# EAGLE design devBoard (EAGLE 9.5.2)
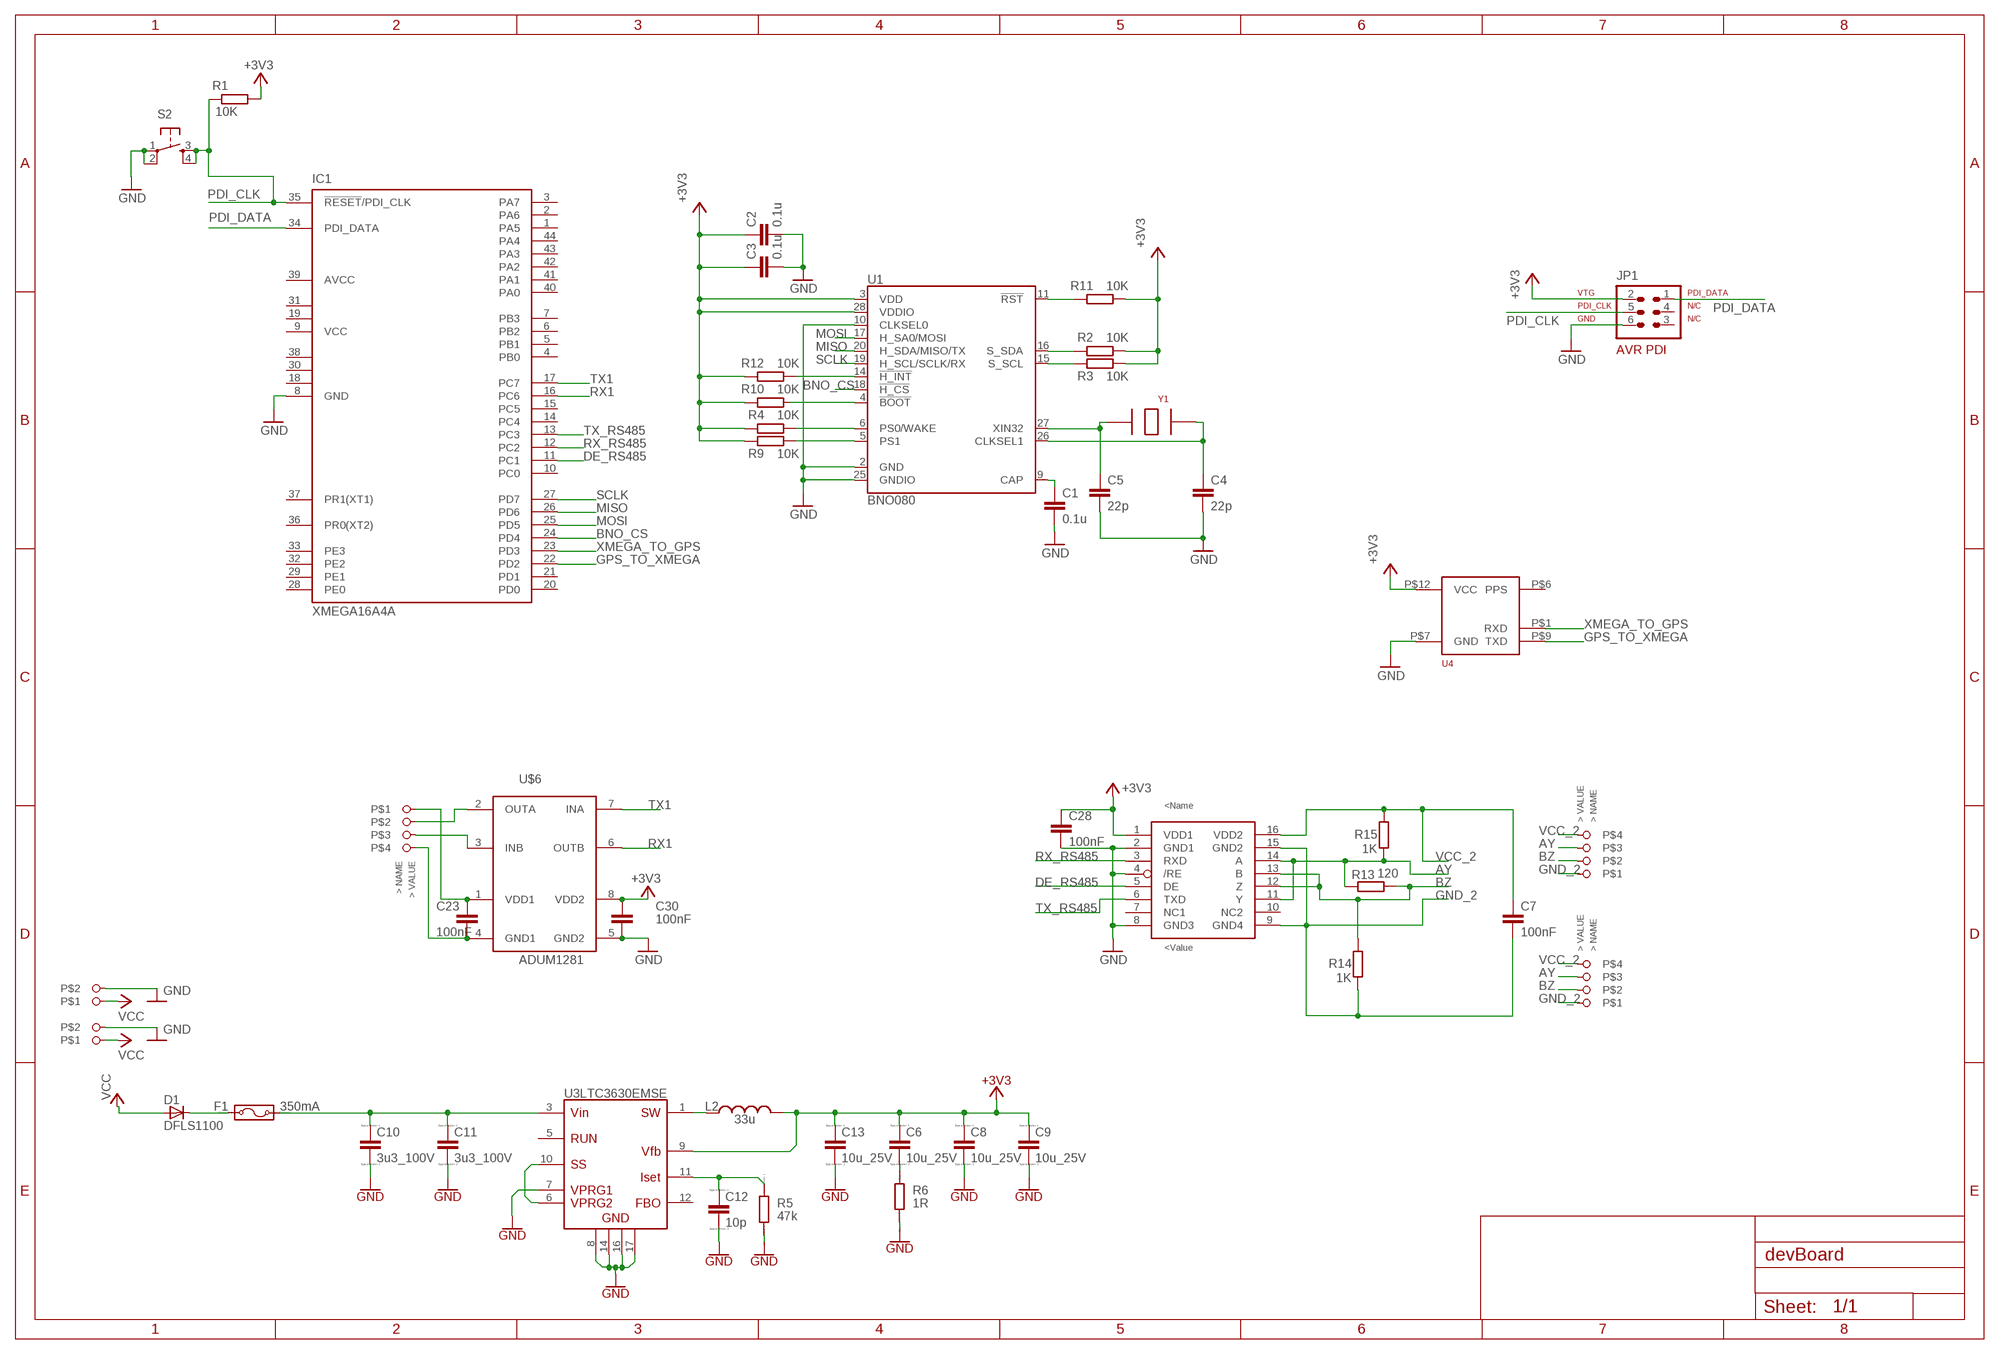
[diagram p0: schematic, sheet 1]

## Parts
ADM1  ADM2484E  [ADM2487]
C1  0.1u  C-EUC0805  [C0805]
C2  0.1u  C-EUC0805  [C0805]
C3  0.1u  C-EUC0805  [C0805]
C4  22p  C-EUC0805  [C0805]
C5  22p  C-EUC0805  [C0805]
C6  10u_25V  CAP1206  [1206]
C7  100nF  C-EUC0805  [C0805]
C8  10u_25V  CAP1206  [1206]
C9  10u_25V  CAP1206  [1206]
C10  3u3_100V  CAP1206  [1206]
C11  3u3_100V  CAP1206  [1206]
C12  10p  CAP0805  [0805]
C13  10u_25V  CAP1206  [1206]
C23  100nF  C-EUC0805  [C0805]
C28  100nF  C-EUC0805  [C0805]
C30  100nF  C-EUC0805  [C0805]
D1  DFLS1100  [POWERDI_123]
F1  350mA  RESETTABLE_FUSE1812  [1812L]
IC1  XMEGA16A4A  [TQFP44]
JP1  AVR-ISP-6ML  [ML6]
L2  33u  DR74  [DR73/74]
POWER1  CON_3.81MM2_SIDE  [CON_3.81MM2_SIDE]
POWER2  CON_3.81MM2_SIDE  [CON_3.81MM2_SIDE]
R1  10K  R-EU_R0805  [R0805]
R2  10K  R-EU_R0805  [R0805]
R3  10K  R-EU_R0805  [R0805]
R4  10K  R-EU_R0805  [R0805]
R5  47k  RES0805  [0805]
R6  1R  RES0805  [0805]
R9  10K  R-EU_R0805  [R0805]
R10  10K  R-EU_R0805  [R0805]
R11  10K  R-EU_R0805  [R0805]
R12  10K  R-EU_R0805  [R0805]
R13  120  R-EU_R0805  [R0805]
R14  1K  R-EU_R0805  [R0805]
R15  1K  R-EU_R0805  [R0805]
S2  TAC_SWITCHPTH  [TACTILE-PTH]
SERIEEL  CON_3,5MM4_SIDE  [CON_3,5MM4_SIDE]
SERIEEL1  CON_3,5MM4_SIDE  [CON_3,5MM4_SIDE]
SERIEEL2  CON_3,5MM4_SIDE  [CON_3,5MM4_SIDE]
U1  BNO080  [LGA-28]
U3  LTC3630EMSE  [MSE16(12)]
U4  NAVSPARK_MININAVSPARK_MINI  [NAVSPARK_MINI]
U$6  ADUM1281  [SOIC8]
Y1  ABS07  [ABS07]

## Nets
+3V3: ADM1.1(VDD1) C2.1 C3.1 C6.1 C8.1 C9.1 C13.1 C28.1 C30.2 JP1.2 L2.2 R1.1 R2.1 R3.1 R4.2 R9.2 R10.2 R11.1 R12.2 U1.3(VDD) U1.28(VDDIO) U3.9(VFB) U4.P$12(VCC) U$6.8(VDD2)
AY: ADM1.11(Y) ADM1.14(A) R13.2 R15.1 SERIEEL1.P3 SERIEEL2.P3
BNO080_BOOT: R10.1 U1.4(!BOOT)
BNO_CS: IC1.24(PD4) U1.18(!H_CS)
BZ: ADM1.12(Z) ADM1.13(B) R13.1 R14.2 SERIEEL1.P2 SERIEEL2.P2
DE_RS485: ADM1.5(DE) IC1.11(PC1)
GND: ADM1.2(GND1) ADM1.4(/RE) ADM1.8(GND3) C1.2 C2.2 C3.2 C4.2 C5.2 C8.2 C9.2 C10.2 C11.2 C12.2 C13.2 C28.2 C30.1 IC1.8(GND) JP1.6 POWER1.P$2 POWER2.P$2 R5.2 R6.2 S2.1 S2.2 U1.2(GND) U1.10(CLKSEL0) U1.25(GNDIO) U3.7(VPRG1) U3.8(GND1) U3.14(GND2) U3.16(GND3) U3.17(GND4) U4.P$7(GND) U$6.5(GND2)
GND4: C23.1 SERIEEL.P4 U$6.4(GND1)
GND_2: ADM1.9(GND4) ADM1.15(GND2) C7.2 R14.1 SERIEEL1.P1 SERIEEL2.P1
GPS_TO_XMEGA: IC1.22(PD2) U4.P$9(TXD)
INB: SERIEEL.P3 U$6.3(INB)
MISO: IC1.26(PD6) U1.20(H_SDA/MISO/TX)
MOSI: IC1.25(PD5) U1.17(H_SA0/MOSI)
N$1: C1.1 U1.9(CAP)
N$2: C10.1 C11.1 F1.2 U3.3(VIN)
N$3: D1.C F1.1
N$4: C5.1 U1.27(XIN32) Y1.P$2
N$5: C4.1 U1.26(CLKSEL1) Y1.P$1
N$6: R2.2 U1.16(S_SDA)
N$7: R3.2 U1.15(S_SCL)
N$8: R4.1 U1.6(PS0/WAKE)
N$9: R9.1 U1.5(PS1)
N$10: R11.2 U1.11(!RST)
N$11: U3.6(VPRG2) U3.10(SS)
N$12: R12.1 U1.14(!H_INT)
N$13: C12.1 R5.1 U3.11(ISET)
N$15: L2.1 U3.1(SW)
N$16: C6.2 R6.1
OUTA: SERIEEL.P2 U$6.2(OUTA)
PDI_CLK: IC1.35(!RESET!/PDI_CLK) JP1.5 R1.2 S2.3 S2.4
PDI_DATA: IC1.34(PDI_DATA) JP1.1
RX1: IC1.16(PC6) U$6.6(OUTB)
RX_RS485: ADM1.3(RXD) IC1.12(PC2)
SCLK: IC1.27(PD7) U1.19(H_SCL/SCLK/RX)
TX1: IC1.17(PC7) U$6.7(INA)
TX_RS485: ADM1.6(TXD) IC1.13(PC3)
VCC [VCC]: D1.A POWER1.P$1 POWER2.P$1
VCC_2: ADM1.16(VDD2) C7.1 R15.2 SERIEEL1.P4 SERIEEL2.P4
VDD_1: C23.2 SERIEEL.P1 U$6.1(VDD1)
XMEGA_TO_GPS: IC1.23(PD3) U4.P$1(RXD)
Unconnected: ADM1.7(NC1) ADM1.10(NC2) IC1.1(PA5) IC1.2(PA6) IC1.3(PA7) IC1.4(PB0) IC1.5(PB1) IC1.6(PB2) IC1.7(PB3) IC1.10(PC0) IC1.14(PC4) IC1.15(PC5) IC1.20(PD0) IC1.21(PD1) IC1.28(PE0) IC1.29(PE1) IC1.32(PE2) IC1.33(PE3) IC1.36(PR0(XT2)) IC1.37(PR1(XT1)) IC1.40(PA0) IC1.41(PA1) IC1.42(PA2) IC1.43(PA3) IC1.44(PA4) JP1.3 JP1.4 U3.5(RUN) U3.12(FBO) U4.P$6(PPS)

## Power pins joined to a net without a drawn wire
AVCC: IC1.39(AVCC)
GND1: IC1.18(GND1)
GND2: IC1.30(GND2)
GND3: IC1.38(GND3)
VCC1: IC1.19(VCC1)
VCC2: IC1.31(VCC2)
VCC_2: IC1.9(VCC)

## Library data of the parts
ADM1 = ADM:ADM2484E
C1-C5 = rcl:C-EU: CAPACITOR, European symbol; SPICEPREFIX: C
C6 C8-C13 = Capacitor:CAP
C7 C23 C28 C30 = rcl:C-EU: CAPACITOR, European symbol
D1 = Diode:DFLS1100
F1 = Fuse:RESETTABLE_FUSE
IC1 = atmel:XMEGA16A4: MICROCONTROLLER Features High-performance, Low-power 8/16-bit AVR XMEGA Microcontroller Non-Volatile Program and Data Memories - 16 KB - 128 KB of In-System Self-Programmable Flash - 4 KB - 8 KB Boot Code Section with Independent Lock Bits - 1 KB - 2 KB EEPROM - 2 KB - 8 KB Internal SRAM Peripheral Features - Four-channel DMA Controller with support for external requests - Eight-channel Event System - Five 16-bit Timer/Counters Three Timer/Counters with 4 Output Compare or Input Capture channels Two Timer/Counters with 2 Output Compare or Input Capture channels High-Resolution Extensions on all Timer/Counters Advanced Waveform Extension on one Timer/Counter - Five USARTs IrDA Extension on one USART - Two Two-Wire Interfaces with dual address match (I2C and SMBus compatible) - Two SPIs (Serial Peripheral Interfaces) peripherals - AES and DES Crypto Engine - 16-bit Real Time Counter with Separate Oscillator - One Twelve-channel, 12-bit, 2 Msps Analog to Digital Converter - One Two-channel, 12-bit, 1 Msps Digital to Analog Converter - Two Analog Comparators with Window compare function - External Interrupts on all General Purpose I/O pins - Programmable Watchdog Timer with Separate On-chip Ultra Low Power Oscillator Special Microcontroller Features - Power-on Reset and Programmable Brown-out Detection - Internal and External Clock Options with PLL - Programmable Multi-level Interrupt Controller - Sleep Modes: Idle, Power-down, Standby, Power-save, Extended Standby - Advanced Programming, Test and Debugging Interfaces PDI (Program and Debug Interface) for programming, test and debugging I/O and Packages - 34 Programmable I/O Lines - 44 - lead TQFP - 44 - pad VQFN/QFN - 49 - ball VFBGA Operating Voltage - 1.6 - 3.6V Speed performance - 0 - 12 MHz @ 1.6 - 3.6V - 0 - 32 MHz @ 2.7 - 3.6V Drawn by Dipl.-Ing. (FH) Robert Siegler Created: 27.05.09; OC_FARNELL: unknown; OC_NEWARK: unknown
JP1 = avr-pdi:AVR-ISP-6: AVR ISP-6 Serial Programming Header
L2 = Inductor:DR74
POWER1 POWER2 = Phoenix-con:CON_3.81MM2_SIDE
R1-R4 R9-R15 = rcl:R-EU_: RESISTOR, European symbol
R5 R6 = Resistor:RES
S2 = SparkFun-Electromechanical:TAC_SWITCH: Momentary Switch Button commonly used for reset or general input. Spark Fun Electronics SKU : COM-00097 SMT- SWCH-08247
SERIEEL SERIEEL1 SERIEEL2 = Phoenix-con:CON_3,5MM4_SIDE
U1 = BNO080:BNO080
U3 = Step_Down_Converter:LTC3630EMSE
U4 = NAVSPARK_MINI:NAVSPARK_MINI
U$6 = ref-packages-v3:ADUM1281
Y1 = ABS07:ABS07

## Net classes
0 default: width 0.2 mm, drill 0.3 mm, clearance 0.2 mm
1 3V3: width 0.5 mm, drill 0.3 mm, clearance 0.2 mm to class 0
4 VCC: width 1 mm, clearance 0.2 mm to class 0

## Board
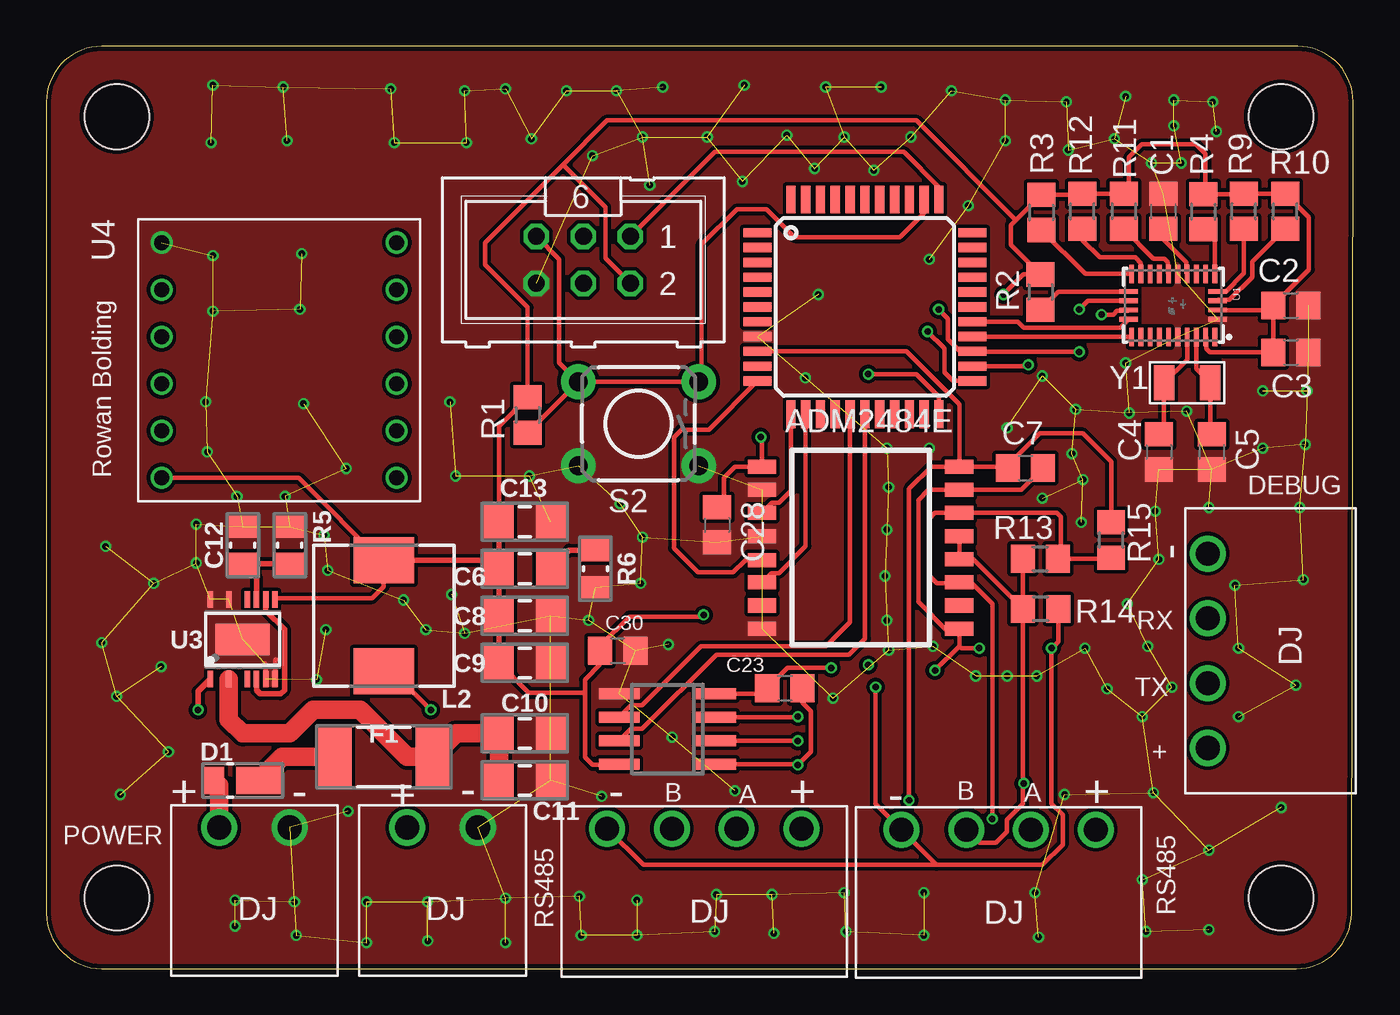
[diagram p1: board, top side]
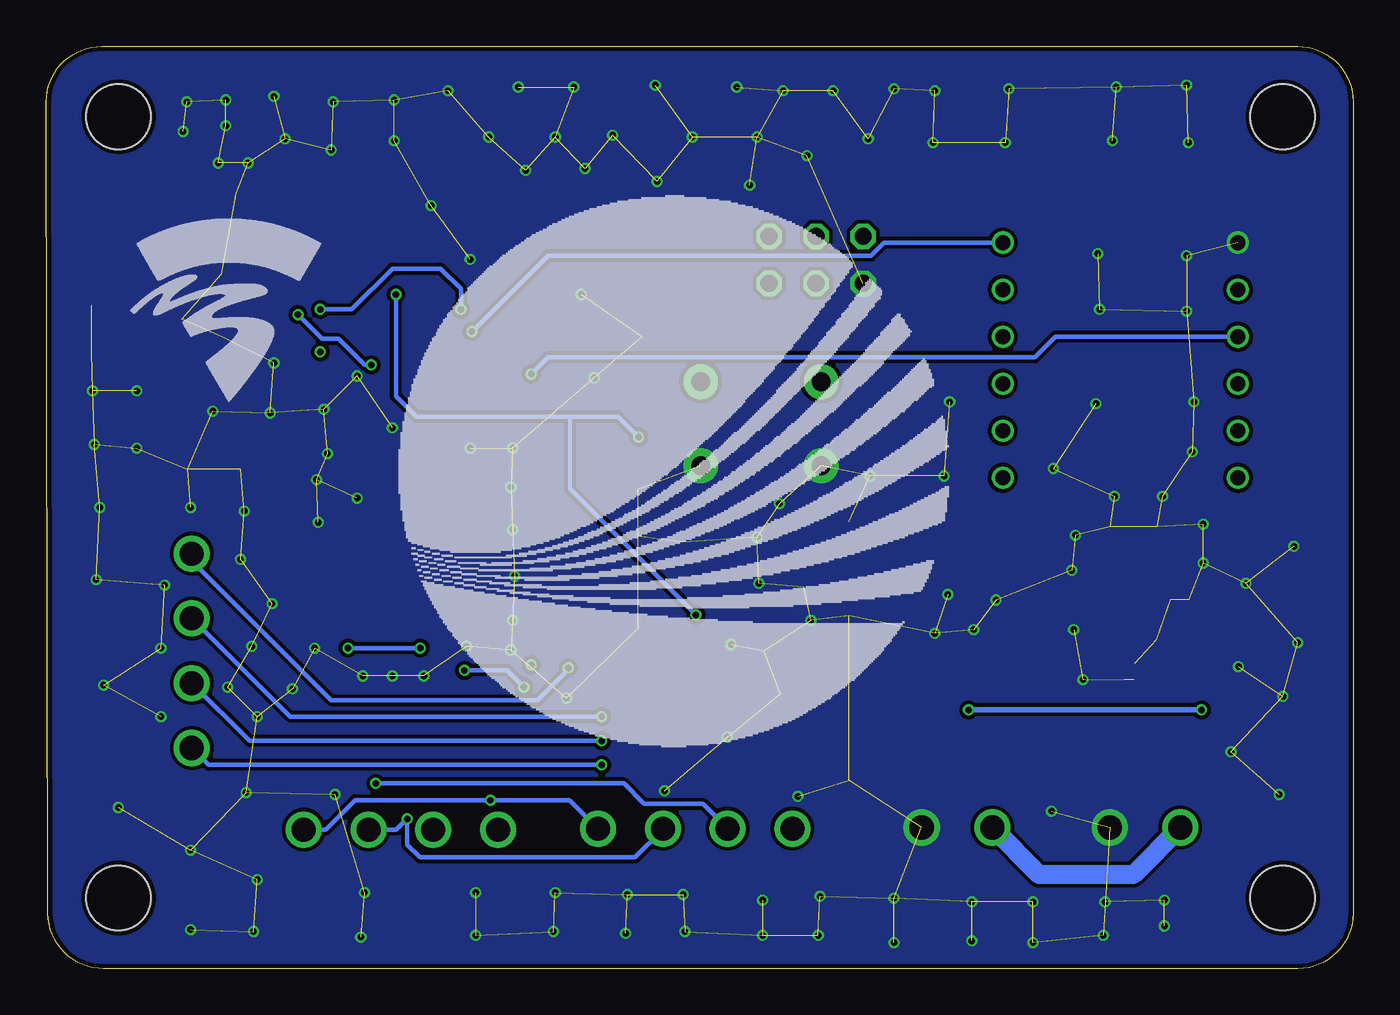
[diagram p2: board, bottom side, seen from below]

Size 70.59 x 49.8 mm. Coordinates in mm from the lower left corner, seen from the top.
Outline: 70.51,2.99 70.59,46.79 arc90 67.59,49.8 3,49.8 arc90 0,46.8 0,2.99 arc90 2.99,0 67.51,0 arc90 70.51,2.99
Copper layers (1*16): Top 0.018mm / dielectric 1.55mm / Bottom 0.018mm
Design rules "eC_2Layer_PClass6_BaseCopperO18_eCDefault": minimum track width 0.15mm, minimum drill 0.35mm, track to track 0.15mm, track to pad 0.15mm, pad to pad 0.15mm, via to via 0.15mm, smd to smd 0mil, copper to edge 0.25mm, drill to drill 0.35mm, minimum pad ring 0.175mm, minimum via ring 0.125mm, stop-mask expansion 0mil, vias tented up to drill 0.45mm, thermal gap 0.2mm
Holes 3.5 mm at 3.81,3.81 3.81,46 66.69,46 66.69,3.81

### Footprints (pad centres in the part's own frame; a part is rotated, then mirrored left to right if it is on the bottom)
ADM2487 = smd 0.76 x 1.525: 1 -4.375,-5.325; 2 -3.125,-5.325; 3 -1.875,-5.325; 4 -0.625,-5.325; 5 0.675,-5.325; 6 1.875,-5.325; 7 3.125,-5.325; 8 4.375,-5.325; 9 4.375,5.325; 10 3.125,5.325; 11 1.875,5.325; 12 0.625,5.325; 13 -0.625,5.325; 14 -1.875,5.325; 15 -3.125,5.325; 16 -4.375,5.325
C0805 = smd 1.3 x 1.5: 1 -0.95,0; 2 0.95,0
1206 = smd 1.6 x 1.8: 1 -1.4,0; 2 1.4,0
0805 = smd 1.2 x 1.5: 1 -1,0; 2 1,0
POWERDI_123 = smd 1.05 x 1.5: A -1.525,0 | smd 2.4 x 1.5: C 0.85,0
1812L = smd 1.8 x 3.15: 1 -2.625,0; 2 2.625,0
TQFP44 = smd 1.5 x 0.5: 1 -5.8,4; 2 -5.8,3.2; 3 -5.8,2.4; 4 -5.8,1.6; 5 -5.8,0.8; 6 -5.8,0; 7 -5.8,-0.8; 8 -5.8,-1.6; 9 -5.8,-2.4; 10 -5.8,-3.2; 11 -5.8,-4; 23 5.8,-4; 24 5.8,-3.2; 25 5.8,-2.4; 26 5.8,-1.6; 27 5.8,-0.8; 28 5.8,0; 29 5.8,0.8; 30 5.8,1.6; 31 5.8,2.4; 32 5.8,3.2; 33 5.8,4 | smd 0.5 x 1.5: 12 -4,-5.8; 13 -3.2,-5.8; 14 -2.4,-5.8; 15 -1.6,-5.8; 16 -0.8,-5.8; 17 0,-5.8; 18 0.8,-5.8; 19 1.6,-5.8; 20 2.4,-5.8; 21 3.2,-5.8; 22 4,-5.8; 34 4,5.8; 35 3.2,5.8; 36 2.4,5.8; 37 1.6,5.8; 38 0.8,5.8; 39 0,5.8; 40 -0.8,5.8; 41 -1.6,5.8; 42 -2.4,5.8; 43 -3.2,5.8; 44 -4,5.8
ML6 = drill 0.914 octagon: 1 -2.54,-1.27; 2 -2.54,1.27; 3 0,-1.27; 4 0,1.27; 5 2.54,-1.27; 6 2.54,1.27
DR73/74 = smd 2.5 x 3.25: 1 -3,0; 2 3,0
CON_3.81MM2_SIDE = drill 1.3: P$1 0,0; P$2 3.81,0
R0805 = smd 1.3 x 1.5: 1 -0.95,0; 2 0.95,0
TACTILE-PTH = drill 1.016 pad 1.88: 1 -3.251,2.261; 2 3.251,2.261; 3 -3.251,-2.261; 4 3.251,-2.261
CON_3,5MM4_SIDE = drill 1.3: P1 -7,0; P2 -3.5,0; P3 0,0; P4 3.5,0
LGA-28 = smd 1 x 0.25: 1 1.7,2.25; 6 -1.7,2.25; 7 -1.7,1.75; 8 -1.7,1.25; 9 -1.7,0.75; 10 -1.7,0.25; 11 -1.7,-0.25; 12 -1.7,-0.75; 13 -1.7,-1.25; 14 -1.7,-1.75; 15 -1.7,-2.25; 20 1.7,-2.25; 21 1.7,-1.75; 22 1.7,-1.25; 23 1.7,-0.75; 24 1.7,-0.25; 25 1.7,0.25; 26 1.7,0.75; 27 1.7,1.25; 28 1.7,1.75 | smd 0.25 x 1: 2 0.75,2.4; 3 0.25,2.4; 4 -0.25,2.4; 5 -0.75,2.4; 16 -0.75,-2.4; 17 -0.25,-2.4; 18 0.25,-2.4; 19 0.75,-2.4
MSE16(12) = smd 0.3 x 0.9: 1 -1.75,-2.15; 3 -0.75,-2.15; 5 0.25,-2.15; 6 0.75,-2.15; 7 1.25,-2.15; 8 1.75,-2.15; 9 1.75,2.15; 10 1.25,2.15; 11 0.75,2.15; 12 0.25,2.15; 14 -0.75,2.15; 16 -1.75,2.15 | smd 2.9 x 1.7: 17 0,0
NAVSPARK_MINI = drill 0.8: P$1 -6.35,6.35; P$2 -3.81,6.35; P$3 -1.27,6.35; P$4 1.27,6.35; P$5 3.81,6.35; P$6 6.35,6.35; P$7 -6.35,-6.35; P$8 -3.81,-6.35; P$9 -1.27,-6.35; P$10 1.27,-6.35; P$11 3.81,-6.35; P$12 6.35,-6.35
SOIC8 = smd 0.6 x 2.2: 1 -1.905,-2.6; 2 -0.635,-2.6; 3 0.635,-2.6; 4 1.905,-2.6; 5 1.905,2.6; 6 0.635,2.6; 7 -0.635,2.6; 8 -1.905,2.6
ABS07 = smd 1.1 x 1.9: P$1 -1.27,0; P$2 1.23,0

### Placement (x,y rotation side)
ADM1  43.99,22.73 270 top
C1  60.34,40.89 90 top
C2  67.22,35.81 0 top
C3  67.22,33.27 0 top
C4  60.1,27.9 270 top
C5  62.95,27.9 270 top
C6  25.85,21.59 0 top
C7  52.89,27.03 0 top
C8  25.85,19.05 0 top
C9  25.85,16.51 0 top
C10  25.85,12.7 0 top
C11  25.85,10.16 0 top
C12  10.61,22.86 90 top
C13  25.85,24.13 0 top
C23  39.89,15.14 0 top
C28  36.23,23.96 270 top
C30  30.87,17.16 180 top
D1  10.61,10.16 0 top
F1  18.23,11.43 0 top
IC1  44.22,35.73 0 top
JP1  29.01,38.27 180 top
L2  18.23,19.05 90 top
POWER1  19.5,7.62 0 top
POWER2  9.34,7.62 0 top
R1  26,29.89 270 top
R2  53.7,36.53 270 top
R3  53.75,40.83 270 top
R4  62.5,40.87 90 top
R5  13.15,22.86 90 top
R6  29.66,21.59 270 top
R9  64.68,40.89 90 top
R10  66.92,40.89 90 top
R11  58.2,40.89 270 top
R12  55.96,40.89 90 top
R13  53.69,22.13 0 top
R14  53.71,19.42 180 top
R15  57.52,23.14 90 top
S2  31.99,29.42 180 top
SERIEEL  62.73,18.91 90 top
SERIEEL1  37.29,7.56 0 top
SERIEEL2  53.19,7.5 0 top
U1  60.87,35.81 270 top
U3  10.61,17.78 0 top
U4  12.58,32.85 270 top
U$1  [LOGO_KLEIN]  51.6,11.9 0 bottom
U$2  [HVA_LOGO]  66.7,29.4 0 bottom
U$6  33.55,12.93 90 top
Y1  61.64,31.63 0 top

### Tracks (layer width: path | path; a pad name or v marks a point on that pad's centre or on a via)
+3V3  (via drill 0.35)
  Top 0.254: 66.27,35.7 C2.1 68.2,37.74 68.2,40.56 R10.2 R9.2 64.66,41.82 62.6,41.82 | 66.27,35.7 C3.1 66.26,33.28 62.86,33.28 62.67,33.48 62.67,34.06 U1.28 | 62.6,41.82 R4.2 | U1.3 66.13,35.56 66.27,35.7 | 52.38,40.41 R3.1 55.9,41.78 R12.2 R11.1 58.48,42.12 | 52.38,40.41 52.1,40.13 52.1,39.08 R2.1 52.78,37.48 v51.7,36.4 | U3.9 12.43,20 17.6,20 18.23,20.63 18.23,21.9 | 18.23,21.9 L2.2 | 29.1,14.9 29.1,15.6 29.92,16.42 C30.2 29.92,17.42 31.5,19 35.4,19 v35.5,19.1 | 29.1,14.9 29.1,11.4 29.5,11 30.93,11 U$6.8 | C28.1 36.6,25.28 36.6,26.5 37.2,27.11 ADM1.1 38.66,28.64 v38.6,28.7 | C13.1 24.45,29.29 R1.1 26,35.7 23.7,38 23.7,39.2 27.9,43.4 | C9.1 26.06,14.9 29.1,14.9 | 27.9,43.4 30.3,45.8 47,45.8 52.38,40.41 | U4.P$12 13.63,26.5 18.23,21.9 | 58.48,41.84 58.48,42.12 | 58.48,42.12 58.48,43.8 59.18,44.5 62.1,44.5 62.6,44 62.6,41.82 | JP1.2 30.2,38.35 30.2,41.1 27.9,43.4
  Top 0.305: L2.2 23.99,22.05 C6.1 | C6.1 C8.1 C9.1 | C6.1 C13.1
  Bottom 0.254: v38.6,28.7 39.7,29.8 42.3,29.8 | v51.7,36.4 51.7,30.9 50.6,29.8 42.3,29.8 | 42.3,29.8 42.3,25.9 v35.5,19.1
AY  (via drill 0.35)
  Top 0.254: v51.1,8.09 51.1,19.7 49.95,20.86 ADM1.11 49.26,20.8 48.1,20.8 47.7,21.2 47.7,24.3 48.01,24.61 ADM1.14 54.59,24.61 54.8,24.4 54.8,22.29 R13.2 57.46,22.13 R15.1
  Bottom 0.254: SERIEEL2.P3 51.69,7.5 v51.1,8.09 51.1,6.7 50.4,6 38.8,6 37.29,7.51 SERIEEL1.P3
BNO080_BOOT
  Top 0.254: R10.1 65.13,38.15 65.13,37.34 63.9,36.11 63.32,36.11 U1.4
BNO_CS  (via drill 0.35)
  Top 0.254: U1.18 58.42,35.51 57.84,35.51 57.63,35.31 v57,35.31 | IC1.24 52.98,32.53 v53.04,32.59
  Bottom 0.254: v57,35.31 55.7,34.01 54.81,34.01 53.4,32.59 v53.04,32.59
BZ  (via drill 0.35)
  Top 0.254: R14.2 50.08,22.11 ADM1.12 ADM1.13 | R13.1 52.74,19.44 R14.2 | R14.2 52.76,10.04 | 52.76,10.04 v52.8,10 | SERIEEL2.P2 50.39,6.8 51.3,6.8 51.89,7.39 51.89,8.04 52.76,8.91 52.76,10.04
  Bottom 0.254: SERIEEL1.P2 35.13,8.9 38.3,8.9 39.4,10 v52.8,10
DE_RS485
  Top 0.254: IC1.11 35.79,29.1 34.3,29.1 33.9,28.7 33.9,22.7 35.2,21.4 37.1,21.4 37.76,22.05 ADM1.5
GND  (via drill 0.35)  (187 unrouted)
  Top 0.254: U3.7 11.86,16.44 11.8,16.5 | U3.8 12.36,16.66 12.38,16.68 12.38,16.7
  other vias: 10.2,2.3 10.2,3.7 13.4,3.6 13.5,1.8 17.3,3.6 17.3,1.4 20.6,3.6 20.6,1.5 24.8,3.8 24.8,1.4 28.8,3.9 28.9,1.8 31.9,3.7 31.9,1.8 36.2,4 36.1,2 39.2,4 39.3,1.9 43.1,4.1 43.2,2 47.4,4.1 47.4,1.8 53.4,4.1 53.6,1.7 59.2,4.8 59.4,2 62.8,6.4 62.8,2.1 59.2,13.6 60.8,15.2 57.3,15.1 59.5,17.4 64.4,17.3 64.4,13.6 64.2,20.7 56.1,17.3 58.4,19.7 60.1,22.1 67.9,21 67.5,15.3 66.7,8.7 59.8,9.5 55,9.4 53.5,15.8 50.2,15.8 51.9,15.8 47.9,17.4 45.4,18.8 45.5,17.2 45.3,21.2 45.4,23.7 45.5,26 45.4,28.1 47.7,28.1 53.8,25.4 56,26.4 55.9,24.1 55.4,27.8 59.9,24.7 62.8,24.9 67.7,24.9 65.7,28.1 68,28.3 65.7,31.2 68.1,31.2 61.6,30.1 58.5,30 58.3,32.7 55.6,30.2 53.8,32 51.9,29.2 41,31.9 41.7,36.4 47.7,38.3 49.8,41.2 46.7,44.9 51.8,44.7 51.8,46.9 55.1,46.8 55.2,44.2 58.3,47.1 57.7,44.8 59.7,43.5 61.3,43.5 60.9,46.9 60.9,45.5 63,46.8 63.2,45.2 48.9,47.4 45.1,47.6 43.1,44.9 42.1,47.6 40,45 37.7,47.7 35.7,44.9 33.3,47.6 32.2,44.9 30.8,47.4 28.1,47.4 24.8,47.5 22.6,47.4 18.6,47.5 12.8,47.6 9,47.7 8.9,44.6 13,44.7 18.8,44.6 22.7,44.6 26.2,44.8 29.5,43.9 32.6,42.3 37.6,42.5 41.5,43.2 44.7,43.1 9,38.5 13.8,38.6 9,35.5 13.7,35.6 8.6,30.6 13.9,30.5 8.7,27.9 16.2,27 22.1,26.6 21.8,30.6 26.1,26.6 31,25.1 32.2,23.3 32.1,20.8 29.3,18.8 19.3,19.9 20.5,18.3 21.9,20.2 22.6,18.1 15.2,21.5 15,23.4 8.1,24 8.1,21.9 10.3,25.5 12.9,25.5 3.2,22.8 5.8,20.8 3,17.6 6.2,16.3 3.8,14.7 6.6,11.7 14.6,15.6 15.1,18.3 16.3,8.5 4,9.4 30,9.3 37.2,9.6 33.6,17.5 33.8,12.5 42.5,14.6
  pour Top (no thermals): 0.1,49.8 0.1,-0.2 0.7,-0.2 0.7,-0.4 70.9,-0.4 70.9,49.9 70.2,49.9 0.1,49.9
  pour Bottom (no thermals): 0,0 70.5,0 70.5,49.8 0,49.8
GND4  (via drill 0.35)
  Top 0.254: U$6.4 38.63,14.84 C23.1 40.04,16.24 v42.4,16.24
  Bottom 0.254: v42.4,16.24 42.4,16.14 44.05,14.49 55.2,14.49 62.73,22.03 SERIEEL.P4
GND_2  (via drill 0.35)
  Top 0.254: ADM1.9 49.31,18.2 | 49.31,18.2 49.31,17.41 | 49.31,17.41 v48,16.1 | 49.31,17.41 49.43,17.3 v50.4,17.3 | R14.1 54.66,17.66 v54.3,17.3 54.3,8.9 54.9,8.3 54.9,6.7 53.8,5.6 48.09,5.6 | C7.2 52.66,25.86 ADM1.15 47.66,25.86 47.1,25.3 47.1,19.8 48.7,18.2 49.31,18.2 | 48.09,5.6 SERIEEL2.P1 44.8,8.89 v44.8,15.2 | 48.09,5.6 32.25,5.6 SERIEEL1.P1
  Bottom 0.254: v44.8,15.2 45.7,16.1 v48,16.1 | v50.4,17.3 v54.3,17.3
GPS_TO_XMEGA  (via drill 0.35)
  Top 0.254: v44.4,32.1 47,32.1 48.22,30.88 IC1.22
  Bottom 0.254: U4.P$9 16.08,34.12 17.2,33 43.5,33 v44.4,32.1
INB  (via drill 0.35)
  Top 0.254: U$6.3 40.56,13.56 v40.6,13.6
  Bottom 0.254: SERIEEL.P3 57.42,13.6 v40.6,13.6
MISO
  Top 0.254: IC1.26 58.6,34.13 U1.20
  Top 0.305: 50.06,34.17 IC1.26
MOSI  (via drill 0.35)
  Top 0.254: v55.8,33.3 50.05,33.3 IC1.25 | IC1.25 | U1.17 56.26,36.06 v55.8,35.6 | v48.2,35.6 48.7,35.1 48.7,33.99 49.36,33.33 IC1.25
  Bottom 0.254: v55.8,35.6 54.1,35.6 51.9,37.8 49.3,37.8 48.2,36.7 v48.2,35.6
N$1
  Top 0.254: U1.9 61.57,37.56 61.57,38.15 60.34,39.38 C1.1
N$2
  Top 1: C11.1 C10.1 22.12,12.7 F1.2 19.5,11.43 16.96,13.97 14.42,13.97 13.15,12.7 10.61,12.7 9.86,13.45 U3.3
N$3
  Top 1: D1.C 12.73,11.43 F1.1
N$4
  Top 0.254: U1.27 62.12,32.38 Y1.P$2 62.87,28.93 C5.1
N$5
  Top 0.254: U1.26 61.62,32.88 Y1.P$1 60.37,29.12 C4.1
N$6
  Top 0.254: U1.16 54.68,36.56 R2.2
N$7
  Top 0.254: R3.2 56.12,37.51 U1.15
N$8
  Top 0.254: R4.1 63.12,39.3 U1.6
N$9
  Top 0.254: R9.1 64.68,37.54 63.7,36.56 U1.5
N$10
  Top 0.254: U1.11 60.57,37.56 60.57,38.15 60.38,38.34 59.8,38.34 R11.2
N$11
  Top 0.305: U3.6 11.36,15.03 11.56,14.83 12.66,14.83 12.86,15.03 12.86,18.33 11.86,19.33 U3.10
N$12
  Top 0.254: R12.1 55.96,39.34 56.9,38.4 58.82,38.4 59.12,38.1 U1.14
N$13
  Top 0.305: R5.1 C12.1 11.36,21.11 U3.11
N$15  (via drill 0.35)
  Top 0.254: 18.69,16.05 v20.77,13.97
  Top 0.305: U3.1 8.19,14.96 v8.19,13.97 | 18.69,16.05 L2.1
  Bottom 0.305: v8.19,13.97 v20.77,13.97
N$16
  Top 0.305: C6.2 28.25,22.59 R6.1
N$30  (via drill 0.35)
  other vias: 44.4,16.4
OUTA  (via drill 0.35)
  Top 0.254: U$6.2 v40.59,12.29 v40.6,12.3
  Bottom 0.254: SERIEEL.P2 59.62,12.3 v40.6,12.3
PDI_CLK
  Top 0.254: R1.2 S2.4 | S2.4 35.2,31.68 | 35.2,31.68 S2.3 | 35.2,31.68 35.4,31.88 35.4,39.1 37.3,41 38.9,41 40.4,39.5 46.1,39.5 47.42,40.82 IC1.35 | JP1.5 27.7,38.31 27.7,32.72 S2.4
PDI_DATA
  Top 0.254: IC1.34 48.22,42.19 46.31,44.1 36.11,44.1 JP1.1
RX1
  Top 0.254: U$6.6 31.59,14.21 32.19,14.21 35.38,17.4 42.12,17.4 43.42,18.7 IC1.16
RX_RS485
  Top 0.254: ADM1.3 39.21,25.15 39.56,25.15 40.22,25.8 IC1.12
SCLK
  Top 0.254: IC1.27 52.49,34.93 52.81,34.6 58.01,34.6 U1.19
TX1
  Top 0.254: U$6.7 31.59,12.94 32.19,12.94 36.19,16.95 43.35,16.95 44.22,17.82 IC1.17
TX_RS485
  Top 0.254: ADM1.6 39.16,21.35 39.56,21.35 41.02,22.8 IC1.13
VCC
  Top 1: D1.A 9.34,9.9 POWER2.P$1
  Bottom 1.016: POWER2.P$1 11.88,5.08 16.96,5.08 POWER1.P$1
VCC_2  (via drill 0.35)
  Top 0.254: ADM1.16 49.31,30.48 46.47,33.33 IC1.9 | ADM1.16 51.87,27.11 | 51.87,27.11 C7.1 | ADM1.16 47.8,27.11 46.6,25.9 v46.6,9.09 | R15.2 57.52,27.38 56,28.9 53.66,28.9 51.87,27.11
  Bottom 0.254: SERIEEL2.P4 55.5,7.5 53.9,9.1 48.52,9.1 | 48.52,9.1 48.51,9.09 | 48.52,9.1 v46.61,9.1 | v46.61,9.1 v46.6,9.09 | SERIEEL1.P4 42.33,9.1 v46.61,9.1
VDD_1  (via drill 0.35)
  Top 0.254: U$6.1 40.58,11.03 v40.6,11 41.3,11.71 41.3,13.89 40.84,14.36 C23.2
  Bottom 0.254: SERIEEL.P1 61.82,11 v40.6,11
XMEGA_TO_GPS  (via drill 0.35)
  Top 0.254: v47.6,34.4 48.5,33.5 48.5,32.2 48.97,31.73 IC1.23
  Bottom 0.254: U4.P$1 25.34,39.2 26.04,38.5 43.5,38.5 v47.6,34.4

### Text on the board
tNames: Rowan Bolding | DEBUG | - | RX | TX | - | + | - | - | - | + | B | A | + | B | A | + | + | POWER | RS485 | RS485